# Altium schematic sheet Config.SchDoc
size A3; DocumentNumber: 7; SheetNumber: 7; SheetTotal: 8
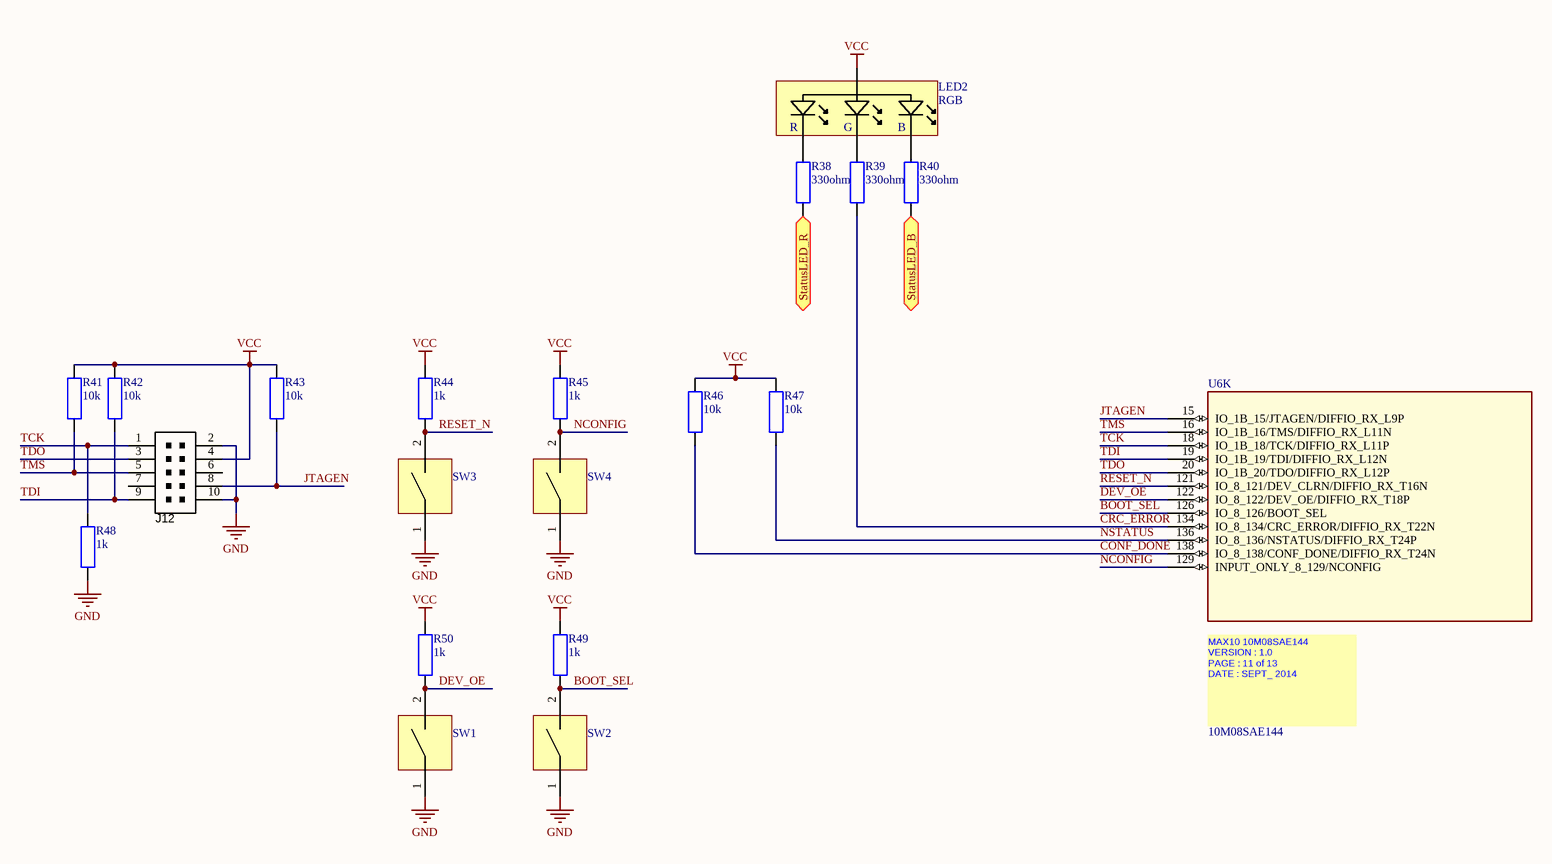
[diagram p0: Config.SchDoc]

## Parts
J12  shrouded box header  [10P_PCB_HEADER_BRD_MNT]  (value not drawn)
LED2  RGB  [ASMB-MTB1]
R38  value 330ohm  [RESC1608X06L]  (hidden comment: MCWR06X3300FTL)
R39  value 330ohm  [RESC1608X06L]  (hidden comment: MCWR06X3300FTL)
R40  value 330ohm  [RESC1608X06L]  (hidden comment: MCWR06X3300FTL)
R41  value 10k  [RESC1608X06L]  (hidden comment: MCMR06X1002FTL)
R42  value 10k  [RESC1608X06L]  (hidden comment: MCMR06X1002FTL)
R43  value 10k  [RESC1608X06L]  (hidden comment: MCMR06X1002FTL)
R44  value 1k  [RESC1608X55N]  (hidden comment: MCMR06X1001FTL)
R45  value 1k  [RESC1608X55N]  (hidden comment: MCMR06X1001FTL)
R46  value 10k  [RESC1608X06L]  (hidden comment: MCMR06X1002FTL)
R47  value 10k  [RESC1608X06L]  (hidden comment: MCMR06X1002FTL)
R48  value 1k  [RESC1608X55N]  (hidden comment: MCMR06X1001FTL)
R49  value 1k  [RESC1608X55N]  (hidden comment: MCMR06X1001FTL)
R50  value 1k  [RESC1608X55N]  (hidden comment: MCMR06X1001FTL)
SW1  FSM4JH  [FSM4JH]  (value not drawn)
SW2  FSM4JH  [FSM4JH]  (value not drawn)
SW3  FSM4JH  [FSM4JH]  (value not drawn)
SW4  FSM4JH  [FSM4JH]  (value not drawn)
U6  10M08SAE144  [SQFP50P2200X2200X165_HS-145N]  (part K of 13)

## Ports
StatusLED_B, StatusLED_R

## Nets
GND: J12.2 J12.10 R48.1 SW1.1 SW2.1 SW3.1 SW4.1
VCC: J12.4 LED2.4(A) R41.2 R42.2 R43.2 R44.2 R45.2 R46.2 R47.2 R49.2 R50.2
BOOT_SEL: R49.1 SW2.2 U6.126(IO_8_126/BOOT_SEL)
CONF_DONE: R46.1 U6.138(IO_8_138/CONF_DONE/DIFFIO_RX_T24N)
CRC_ERROR: R39.2 U6.134(IO_8_134/CRC_ERROR/DIFFIO_RX_T22N)
DEV_OE: R50.1 SW1.2 U6.122(IO_8_122/DEV_OE/DIFFIO_RX_T18P)
JTAGEN: J12.8 R43.1 U6.15(IO_1B_15/JTAGEN/DIFFIO_RX_L9P)
NCONFIG: R45.1 SW4.2 U6.129(INPUT_ONLY_8_129/NCONFIG)
NSTATUS: R47.1 U6.136(IO_8_136/NSTATUS/DIFFIO_RX_T24P)
RESET_N: R44.1 SW3.2 U6.121(IO_8_121/DEV_CLRN/DIFFIO_RX_T16N)
StatusLED_B: R40.2 ; port StatusLED_B
StatusLED_R: R38.2 ; port StatusLED_R
TCK: J12.1 R48.2 U6.18(IO_1B_18/TCK/DIFFIO_RX_L11P)
TDI: J12.9 R42.1 U6.19(IO_1B_19/TDI/DIFFIO_RX_L12N)
TDO: J12.3 U6.20(IO_1B_20/TDO/DIFFIO_RX_L12P)
TMS: J12.5 R41.1 U6.16(IO_1B_16/TMS/DIFFIO_RX_L11N)
NetLED2_1: LED2.1(R) R38.1
NetLED2_2: LED2.2(G) R39.1
NetLED2_3: LED2.3(B) R40.1

Not connected (* = marked no-connect by the designer): J12 6 7

## Notes on the sheet
- (in symbol 10M08SAE144, part K) MAX10 10M08SAE144 / VERSION : 1.0 / PAGE : 11 of 13 / DATE : SEPT_ 2014 /

## Library data of the parts
J12 = CONN_HEADER_2x5P_0.100in_Male: Header THD 10 POS Double-row 2.54mm pitch; Manufacturer 1: 3M; Manufacturer Part Number 1: D2510-6002-AR; Pitch: 0.100" (2.54mm); Value: Double-row, 10 positions; QtyOverride: 1; Connector Type: Header, Shrouded; Number of Positions: 10; SCDType: undef; Package / Case: Connector header; 2.54mm pitch; Contact Type: Male Pin; Number of Rows: 2; Row Spacing: 0.100" (2.54mm); Contact Mating Length: 0.243" (6.17mm); ComponentLink1URL: http://multimedia.3m.com/mws/mediawebserver?66666UuZjcFSLXTtm8T_oxMcEVuQEcuZgVs6EVs6E666666--; ComponentLink1Description: http://multimedia.3m.com/mws/mediawebserver?66666UuZjcFSLXTtm8T_oxMcEVuQEcuZgVs6EVs6E666666--; Supplier 1: Digi-Key; Supplier Part Number 1: MHC10E-ND
LED2 = ASMB-MTB1-0A3A2: LED, HB, RGB, 0.09W, PLCC-4; Supplier 1: Farnell; Supplier Part Number 1: 2401106
R38-R40 = MCWR06X3300FTL: RES, THICK FILM, 330 OHM, 1%, 0.1W; Supplier 1: Farnell; Supplier Part Number 1: 2447339RL; Supplier 2: Farnell; Supplier Part Number 2: 2446656; Supplier 3: Farnell; Supplier Part Number 3: 2447339
R41-R43 R46 R47 = MCMR06X1002FTL: Resistor, 10k, 0603; Supplier 1: Farnell; Supplier Part Number 1: 2073349; Supplier 2: Farnell; Supplier Part Number 2: 2073349RL
R44 R45 R48-R50 = MCMR06X1001FTL: RESISTOR, CERAMIC, 1K, 0.1W, 1%; Supplier 1: Farnell; Supplier Part Number 1: 2073348; Supplier 2: Farnell; Supplier Part Number 2: 2073348RL
SW1-SW4 = FSM4JH: SWITCH, SPNO, 0.05A; Supplier 1: Farnell; Supplier Part Number 1: 1555982
U6 = 10M08SAE144: SWAP_INFO: (S1+S2+S3+S4+S5+S6+S7+S8+S9+S10+S11+S12+S13); SPLIT_INST: TRUE